# Altium schematic sheet PROC051C_RST_LEDs.SchDoc: Pwr_RST_LEDs
size 431 x 279 mm; Date: Not shown in title block; ApprovedBy: Not shown in title block; CheckedBy: Not shown in title block; Author: Not shown in title block; CompanyName: Not shown in title block; Engineer: Not shown in title block; Organization: Not shown in title block; Address1: Not shown in title block; Address2: Not shown in title block; Address3: Not shown in title block; Address4: Not shown in title block; DocumentNumber: 8; Revision: Use project parameter SCH_Rev; SheetNumber: 8; SheetTotal: 16; PageSetup: Record=PageOptions|CenterHorizontal=True|CenterVertical=True|PrintScale=1.00|XCorrection=1.00|YCorrection=1.00|PrintKind=0|BorderSize=5000000|LeftOffset=0|BottomOffset=0|Orientation=2|PaperLength=1000|PaperWidth=1000|Scale=100|PaperSource=15|PrintQuality=600|MediaType=1|DitherType=10|PaperKind=Letter|PrintScaleMode=1; CurrentTime: Not shown in title block; CurrentDate: Not shown in title block; Time: Not shown in title block; DocumentFullPathAndName: Not shown in title block; DocumentName: Not shown in title block; ModifiedDate: Not shown in title block; ImagePath: Not shown in title block
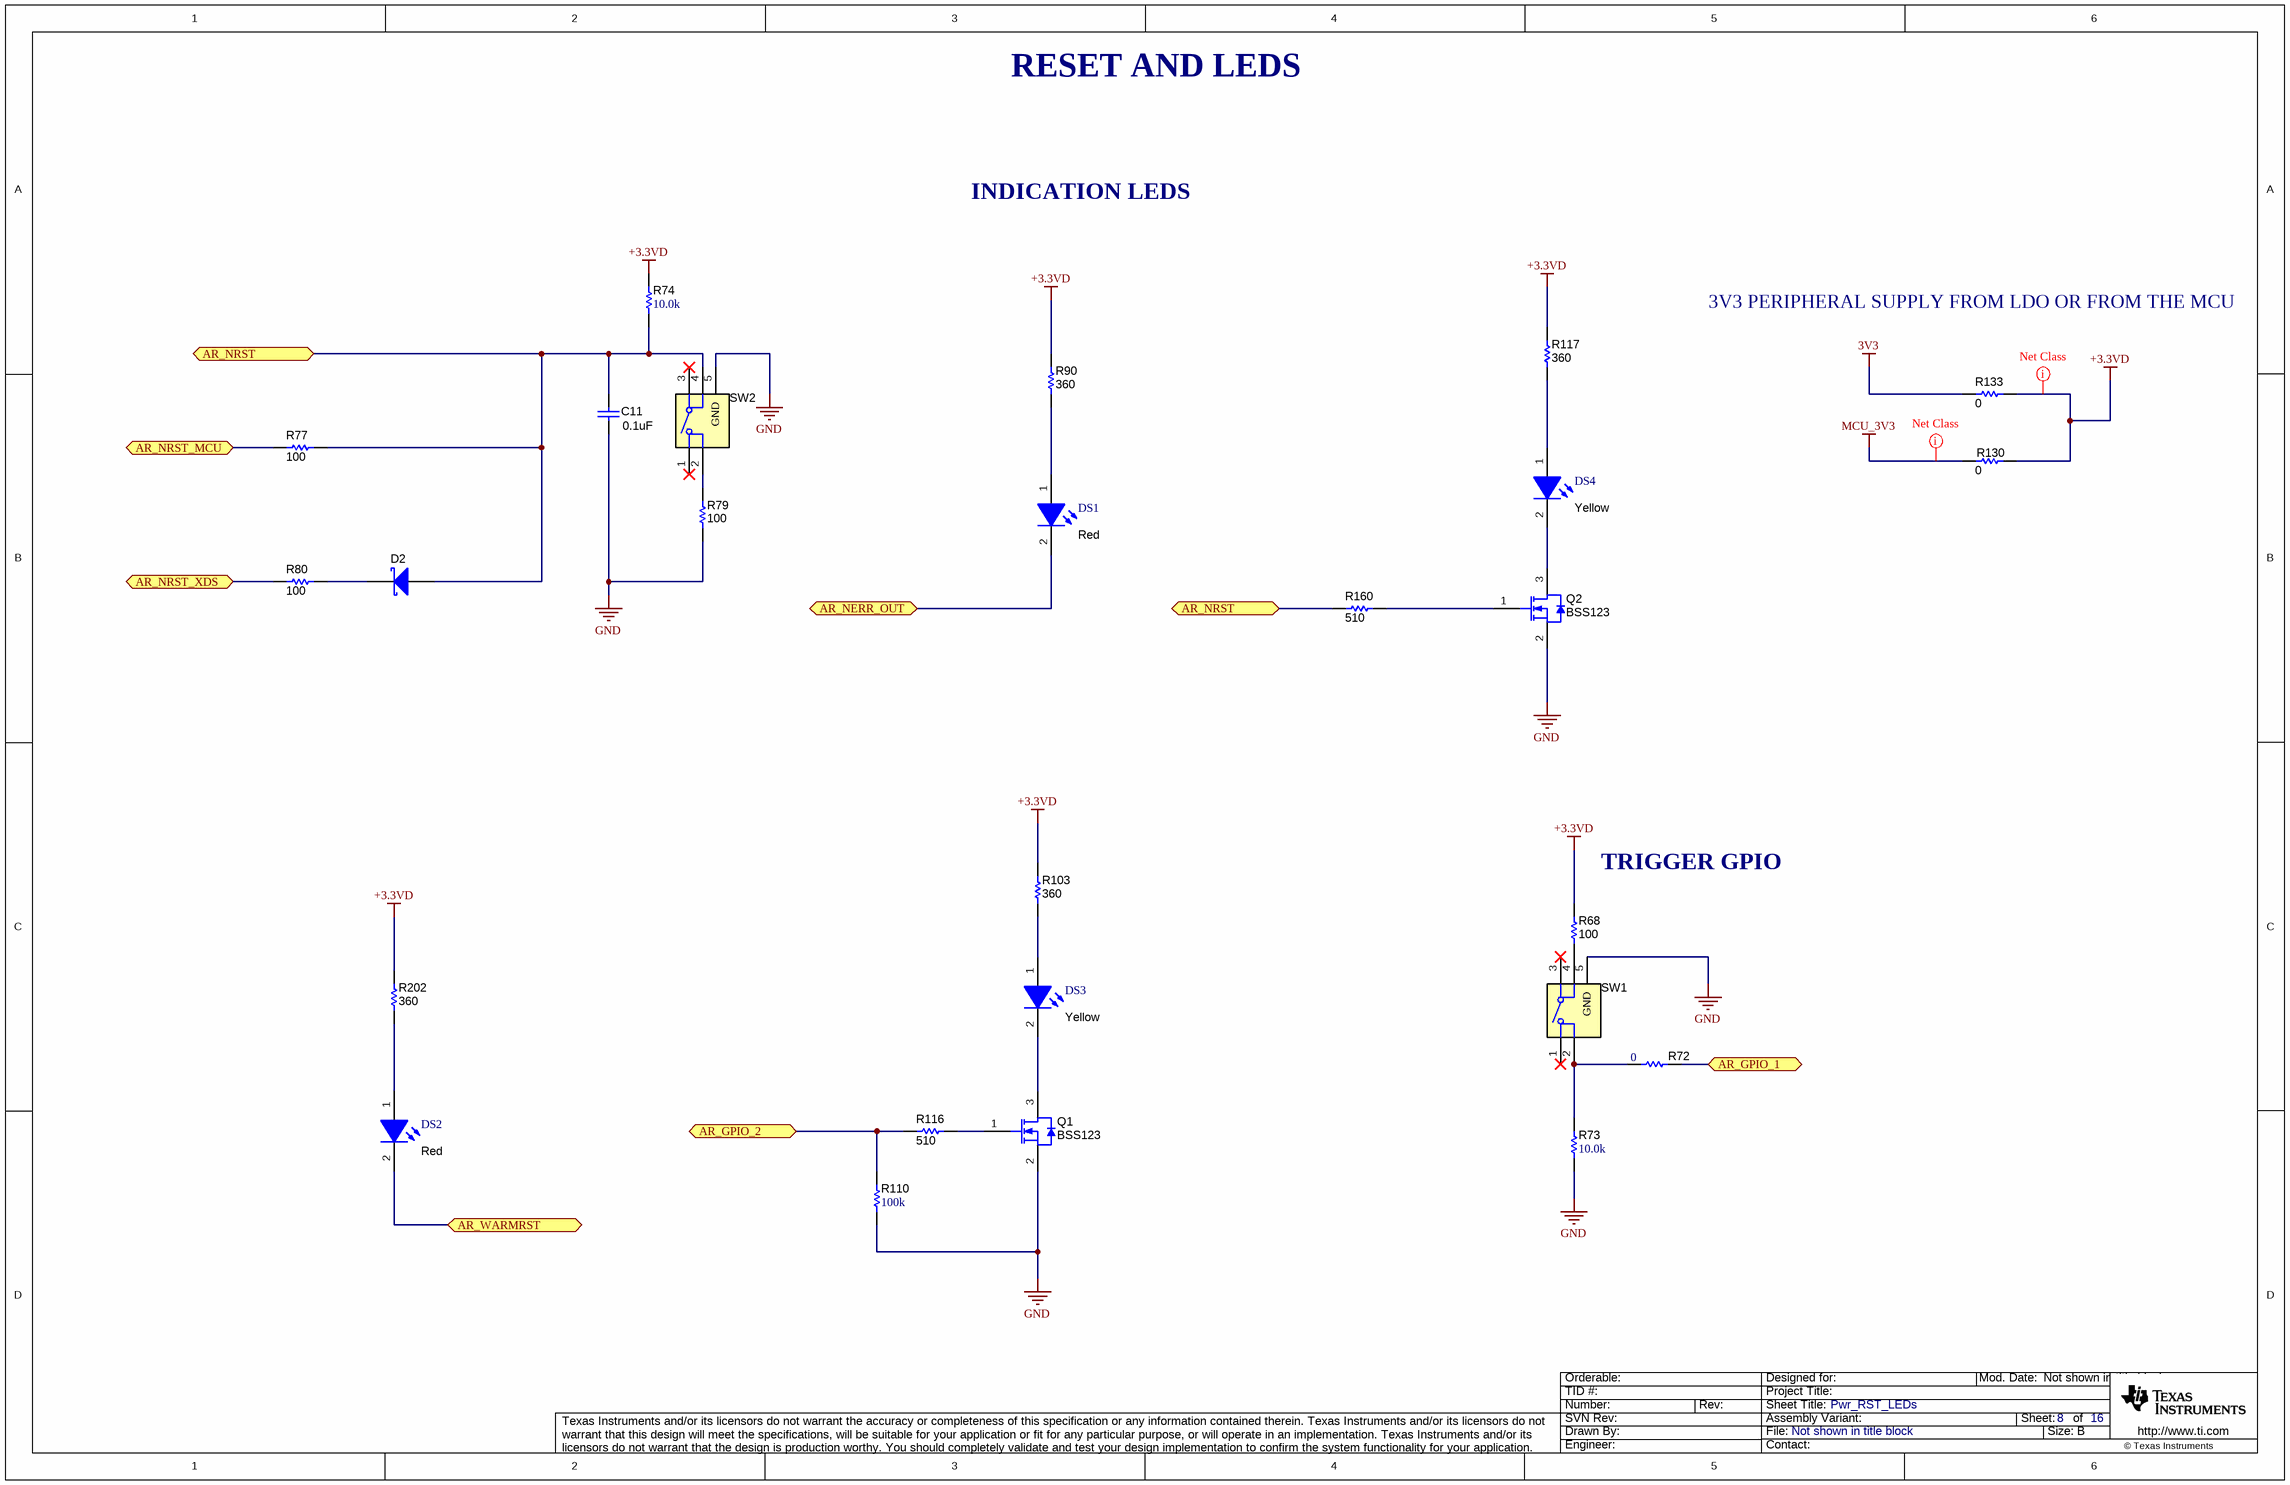
[diagram p0: PROC051C_RST_LEDs.SchDoc]

## Parts
C11  ValueDisplayed: 0.1uF  [0402L]  (hidden comment: GCM155R71C104KA55D)
D2  SMS3923-040LF  [SOD-882]  (value not drawn)
DS1  value Red  [LS L29K_Red]  (hidden comment: LS L29K-G1J2-1-Z)
DS2  value Red  [LS L29K_Red]  (hidden comment: LS L29K-G1J2-1-Z)
DS3  value Yellow  [SML-E1_Yellow]  (hidden comment: SML-E12Y8WT86)
DS4  value Yellow  [SML-E1_Yellow]  (hidden comment: SML-E12Y8WT86)
Q1  BSS123  [SOT-23]
Q2  BSS123  [SOT-23]
R68  ValueDisplayed: 100  [0402L]  (hidden comment: ERJ-2GEJ101X)
R72  ValueDisplayed: 0  [0201_Silk]  (hidden comment: CRCW02010000Z0ED)
R73  ValueDisplayed: 10.0k  [0402L]  (hidden comment: CRCW040210K0FKED)
R74  ValueDisplayed: 10.0k  [0402L]  (hidden comment: CRCW040210K0FKED)
R77  ValueDisplayed: 100  [0402L]  (hidden comment: ERJ-2GEJ101X)
R79  ValueDisplayed: 100  [0402L]  (hidden comment: ERJ-2GEJ101X)
R80  ValueDisplayed: 100  [0402L]  (hidden comment: ERJ-2GEJ101X)
R90  ValueDisplayed: 360  [0402L]  (hidden comment: ERJ-2GEJ361X)
R103  ValueDisplayed: 360  [0402L]  (hidden comment: ERJ-2GEJ361X)
R110  ValueDisplayed: 100k  [0402L]  (hidden comment: CRCW0402100KFKED)
R116  ValueDisplayed: 510  [0402L]  (hidden comment: ERJ-2GEJ511X)
R117  ValueDisplayed: 360  [0402L]  (hidden comment: ERJ-2GEJ361X)
R130  ValueDisplayed: 0  [0603]  (hidden comment: MCT06030Z0000ZP500)
R133  ValueDisplayed: 0  [0603]  (hidden comment: MCT06030Z0000ZP500)
R160  ValueDisplayed: 510  [0402L]  (hidden comment: ERJ-2GEJ511X)
R202  ValueDisplayed: 360  [0402L]  (hidden comment: ERJ-2GEJ361X)
SW1  KMR243GLFG  [SW_KMR243GLFG]  (value not drawn)
SW2  KMR243GLFG  [SW_KMR243GLFG]  (value not drawn)

## Ports
AR_GPIO_1, AR_GPIO_2, AR_NERR_OUT, AR_NRST, AR_NRST_MCU, AR_NRST_XDS, AR_WARMRST

## Nets
3V3: R133.1
+3.3VD: R68.2 R74.2 R90.2 R103.2 R117.2 R130.2 R133.2 R202.2
GND: C11.1 Q1.2(S) Q2.2(S) R73.1 R79.1 R110.1 SW1.5(GND) SW2.5(GND)
MCU_3V3: R130.1
AR_GPIO_1: R72.2 ; port AR_GPIO_1
AR_GPIO_2: R110.2 R116.1 ; port AR_GPIO_2
AR_NERR_OUT: DS1.2(K) ; port AR_NERR_OUT
AR_NRST: C11.2 D2.2(A) R74.1 R77.2 R160.1 SW2.4 ; port AR_NRST
AR_NRST_MCU: R77.1 ; port AR_NRST_MCU
AR_NRST_XDS: R80.1 ; port AR_NRST_XDS
AR_WARMRST: DS2.2(K) ; port AR_WARMRST
NetD2_1: D2.1(K) R80.2
NetDS1_1: DS1.1(A) R90.1
NetDS2_1: DS2.1(A) R202.1
NetDS3_1: DS3.1(A) R103.1
NetDS3_2: DS3.2(K) Q1.3(D)
NetDS4_1: DS4.1(A) R117.1
NetDS4_2: DS4.2(K) Q2.3(D)
NetQ1_1: Q1.1(G) R116.2
NetQ2_1: Q2.1(G) R160.2
NetR68_1: R68.1 SW1.4
NetR72_1: R72.1 R73.2 SW1.2
NetR79_2: R79.2 SW2.2

Not connected (* = marked no-connect by the designer): SW1 1* 3*; SW2 1* 3*

## Layout directives
net class PWR: +3.3VD, MCU_3V3

## Notes on the sheet
- RESET AND LEDS
- INDICATION LEDS
- 3V3 PERIPHERAL SUPPLY FROM LDO OR FROM THE MCU
- (near R68) TRIGGER GPIO
- Drawn By:
- SVN Rev:
- Number:
- TID #:
- Orderable:
- Rev:
- Sheet Title:
- File:
- Project Title:
- Designed for:
- Assembly Variant:
- Mod. Date:
- Sheet:
- Size:
- of
- B
- http://www.ti.com
- Texas Instruments and/or its licensors do not warrant the accuracy or completeness of this specification or any information contained therein. Texas Instruments and/or its licensors do not warrant that this design will meet the specifications, will be suitable for your application or fit for any particular purpose, or will operate in an implementation. Texas Instruments and/or its licensors do not warrant that the design is production worthy. You should completely validate and test your design implementation to confirm the system functionality for your application.
- Engineer:
- Contact:
- © Texas Instruments

## Library data of the parts
C11 = CMP-0006351-2: CAP, CERM, 0.1 uF, 16 V, +/- 10%, X7R, 0402; Manufacturer: MuRata; TaMin_C: -55°C; Polarized: N; SizeAreaWB_mm2: 3; Value1: Unknown; U/M: EA; Value: 0.1uF; TaMax_C: 125°C; SizeZ_mm: 0.6; SizeX_mm: 1; SizeY_mm: 0.5; Cap_Case: 0402; Value2: 16V; Cap_F: 100nF; AEC Category: Q200; Publisher: Texas Instruments; TempCo: X7R; Published: 2008-06-19; RoHS: Y; MountType: SMT; Supplier 1: Digi-Key; PackageReference: 0402; Tolerance_%: 10%; SizeArea_mm2: 0.5; CompType: Capacitor; LatestRevisionDate: 2017-03-09; PartNumber: GCM155R71C104KA55D; AEC Qualified: ?; VDC_V: 16V; ComponentLink1Description: Datasheet link; Supplier Part Number 1: 490-4759-2-ND; Technology: Ceramic; ComponentLink1URL: http://psearch.murata.com/capacitor/product/GCM155R71C104KA55%23.pdf
D2 = CMP-0078187-2: Diode, Schottky,  V, 0.01 A, SOD-882; Manufacturer: Skyworks Solutions; SizeAreaWB_mm2: 3.2; SizeArea_mm2: 0.6; AEC Qualified: N; TJmax_C: 150°C; AEC Category: Q101; SizeZ_mm: 0.5; Io_A: 10mA; Vf_V: 340mV; Value2: 0.34V; Value1: 0.01A; SizeX_mm: 1; ComponentLink1Description: Datasheet link; RoHS: Y; PackageReference: SOD-882; Value: V; PartNumber: SMS3923-040LF; SizeY_mm: 0.6; ComponentLink1URL: http://www.skyworksinc.com/uploads/documents/SMS392x_Series_200042AC.pdf; CompType: Diode; MountType: SMT; Type: Schottky
DS1 DS2 = CMP-0002902-2: LED, Red, SMD; Manufacturer: OSRAM; Io_A: 20mA; Vr_V: 12V; Tjmax_C: 110°C; Value1: W; Angle: 160; Vf_V: 1.8V; ComponentLink1URL: http://www.osram-os.com/Graphics/XPic2/00077099_0.pdf; Color: Red; RoHS: Y; MountType: SMT; PackageReference: SMD, 2-Leads, Body 1.3x0.8mm; Value2: 1.8V; CompType: LED; Type: ?; PartNumber: LS L29K-G1J2-1-Z; ComponentLink1Description: Datasheet link
DS3 DS4 = CMP-0002977-3: LED, Yellow, SMD; Manufacturer: Rohm; Io_A: 20mA; Power_TotalModule: 54mW; Vr_V: 5V; Tjmax_C: 85°C; Value1: 0.054W; Ir_A: 10µA; Vf_V: 2.2V; LuminousIntensity_IV: 63; Color: yellow; RoHS: Y; MountType: SMT; PackageReference: 1.6x0.8mm; Value2: 2.2V; CompType: LED; Type: ?; PartNumber: SML-E12Y8WT86; ComponentLink1Description: Datasheet link; ComponentLink1URL: http://rohmfs.rohm.com/en/products/databook/datasheet/opto/led/chip_mono/sml-e1.pdf
Q1 Q2 = CMP-0000947-2: MOSFET, N-CH, 100 V, 0.17 A, SOT-23; Alternate Manufacturer: None; Manufacturer: Fairchild Semiconductor; SizeZ_mm: 1.1; ChType: N; Value2: 1.8 nC; Value1: 1; VdsMax_V: 100V; SizeX_mm: 2.5; SizeY_mm: 3; Vgs_V: 20V; Value: 100V; Rdson45_ohm: 10; SizeArea_mm2: 7.5; AEC Category: Q101; IdsMax_A: 1.7dA; SizeAreaWB_mm2: 14; U/M: EA; QgTyp_nC: 1.8; Supplier 2: Newark; Supplier 3: Mouser; Supplier 1: Digi-Key; Supplier Part Number 1: BSS123NCT-ND; Supplier Part Number 2: 58K8768; PartNumber: BSS123; ComponentLink1Description: Datasheet link; LatestRevisionDate: 2017-03-09; CompType: MOSFET; PackageReference: SOT-23; LatestRevisionNote: Added parts.; Publisher: Texas Instruments; AEC Qualified: ?; Published: 2008-06-19; Supplier Part Number 3: 512-BSS123; RoHS: Y; MountType: SMT; ComponentLink1URL: http://www.fairchildsemi.com/ds/BS/BSS123.pdf
R68 R77 R79 R80 = CMP-0026993-2: RES, 100, 5%, 0.1 W, AEC-Q200 Grade 0, 0402; Manufacturer: Panasonic; Power_W: 100mW; TempCo: 200 ppm/C; Value_Code: 100R; U/M: EA; Value: 100; EIA_Code: E24; SizeX_mm: 1; SizeY_mm: 0.5; SizeZ_mm: 0.6; Value2: 0.1W; AEC Qualified: Y; AEC Grade: 0; AEC Category: Q200; Supplier Part Number 2: 65T8246; Publisher: Texas Instruments; Supplier 2: Newark; Supplier Part Number 3: 2059210; Supplier 3: Farnell; Published: 2008-06-26; RoHS: Y; Value1: 5%; MountType: SMT; Supplier 1: Digi-Key; PackageReference: 0402; Tolerance_%: 5%; Res_ohm: 100; SizeArea_mm2: 0.5; CompType: Resistor; LatestRevisionDate: 2017-03-09; PartNumber: ERJ-2GEJ101X; ComponentLink1Description: Datasheet link; Supplier Part Number 1: P100JCT-ND; Technology: Thick Film; ComponentLink1URL: https://industrial.panasonic.com/cdbs/www-data/pdf/RDA0000/AOA0000C84.pdf
R72 = CMP-0027008-4: RES, 0, 5%, 0.05 W, 0201; Manufacturer: Vishay-Dale; Power_W: 50mW; TempCo: ppm/C; Value_Code: 0000; Value: 0; EIA_Code: E24; SizeX_mm: 0.6; SizeY_mm: 0.3; SizeZ_mm: 0.26; Value2: 0.05W; SizeArea_mm2: 0.18; AEC Qualified: N; AEC Category: Q200; RoHS: E; Value1: 5%; MountType: SMT; Supplier 1: Newark; PackageReference: 0201; Tolerance_%: 5%; Res_ohm: 0; CompType: Resistor; PartNumber: CRCW02010000Z0ED; ComponentLink1Description: Datasheet link; AEC Grade: N/A; Supplier Part Number 1: 72M6743; Technology: Thick Film; ComponentLink1URL: http://www.vishay.com/docs/20052/crcw0201e3.pdf
R73 R74 = CMP-0025958-3: RES, 10.0 k, 1%, 0.063 W, AEC-Q200 Grade 0, 0402; Manufacturer: Vishay-Dale; Power_W: 63mW; TempCo: 100 ppm/C; Value_Code: 10k0; Value: 10.0k; EIA_Code: E96; Res_ohm: 10k; SizeX_mm: 1; SizeY_mm: 0.5; SizeZ_mm: 0.6; Value2: 0.063W; AEC Qualified: Y; VDC_V: 50V; AEC Category: Q200; AEC Grade: 0; Supplier Part Number 2: 52K6595; Supplier 2: Newark; Supplier Part Number 3: 71-CRCW0402-10K-E3; Supplier 3: Mouser; RoHS: E; Value1: 1%; MountType: SMT; Supplier 1: Digi-Key; PackageReference: 0402; Tolerance_%: 1%; SizeArea_mm2: 0.5; CompType: Resistor; PartNumber: CRCW040210K0FKED; ComponentLink1Description: Datasheet link; Supplier Part Number 1: 541-10.0KLCT-ND; Technology: Thick Film; ComponentLink1URL: http://www.vishay.com/docs/20035/dcrcwe3.pdf
R90 R103 R117 R202 = CMP-0078194-1: RES, 360, 5%, 0.1 W, AEC-Q200 Grade 0, 0402; Manufacturer: Panasonic; Value_Code: 360R; SizeArea_mm2: 0.5; AEC Qualified: Y; AEC Category: Q200; Value: 360; SizeZ_mm: 0.6; EIA_Code: E24; TempCo: 200 ppm/C; AEC Grade: 0; Power_W: 100mW; VDC_V: 50V; Value2: 0.1W; U/M: EA; SizeX_mm: 1; ComponentLink1Description: Datasheet link; RoHS: Y; Supplier Part Number 3: 667-ERJ-2GEJ361X; Tolerance_%: 5%; Supplier 1: Digi-Key; PackageReference: 0402; Technology: Thick Film; Res_ohm: 360; PartNumber: ERJ-2GEJ361X; Supplier Part Number 2: 53W4165; Supplier 2: Newark; SizeY_mm: 0.5; ComponentLink1URL: https://industrial.panasonic.com/cdbs/www-data/pdf/RDA0000/DMA0000COL9.pdf; Value1: 5%; CompType: Resistor; MountType: SMT; Supplier Part Number 1: P360JCT-ND; Supplier 3: Mouser
R110 = CMP-0025950-3: RES, 100 k, 1%, 0.063 W, AEC-Q200 Grade 0, 0402; Manufacturer: Vishay-Dale; Power_W: 63mW; TempCo: 100 ppm/C; Value: 100k; EIA_Code: E96; SizeX_mm: 1; SizeY_mm: 0.5; SizeZ_mm: 0.6; Value2: 0.063W; AEC Qualified: Y; VDC_V: 50V; AEC Category: Q200; AEC Grade: 0; Supplier Part Number 2: 52K6607; Supplier 2: Newark; Supplier Part Number 3: 71-CRCW0402-100K-E3; Supplier 3: Mouser; Value_Code: 100k; RoHS: E; Value1: 1%; MountType: SMT; Supplier 1: Digi-Key; PackageReference: 0402; Tolerance_%: 1%; Res_ohm: 100k; SizeArea_mm2: 0.5; CompType: Resistor; PartNumber: CRCW0402100KFKED; ComponentLink1Description: Datasheet link; Supplier Part Number 1: 541-100KLCT-ND; Technology: Thick Film; ComponentLink1URL: http://www.vishay.com/docs/20035/dcrcwe3.pdf
R116 R160 = CMP-0078212-1: RES, 510, 5%, 0.1 W, AEC-Q200 Grade 0, 0402; Manufacturer: Panasonic; Value_Code: 510R; SizeArea_mm2: 0.5; AEC Qualified: Y; AEC Category: Q200; Value: 510; SizeZ_mm: 0.6; EIA_Code: E24; TempCo: 200 ppm/C; AEC Grade: 0; Power_W: 100mW; VDC_V: 50V; Value2: 0.1W; U/M: EA; SizeX_mm: 1; ComponentLink1Description: Datasheet link; RoHS: Y; Supplier Part Number 3: 667-ERJ-2GEJ511X; Tolerance_%: 5%; Supplier 1: Digi-Key; PackageReference: 0402; Technology: Thick Film; Res_ohm: 510; PartNumber: ERJ-2GEJ511X; Supplier Part Number 2: 65T8293; Supplier 2: Newark; SizeY_mm: 0.5; ComponentLink1URL: https://industrial.panasonic.com/cdbs/www-data/pdf/RDA0000/DMA0000COL9.pdf; Value1: 5%; CompType: Resistor; MountType: SMT; Supplier Part Number 1: P510JCT-ND; Supplier 3: Mouser
R130 = CMP-0025884-3: RES, 0, 5%, 0.125 W, 0603; Manufacturer: Vishay/Beyschlag; Power_W: 125mW; TempCo: ppm/C; Value_Code: 0000; U/M: EA; Value: 0; EIA_Code: E24; SizeX_mm: 1.6; SizeY_mm: 0.8; SizeZ_mm: 1; Value2: 0.125W; SizeArea_mm2: 1.28; CompType: Resistor; AEC Qualified: N; AEC Category: Q200; Supplier Part Number 2: 96Y9454; Publisher: Texas Instruments; Supplier 2: Newark; Supplier Part Number 3: 594-MCT06030Z0000ZP5; Supplier 3: Mouser; Published: 2008-06-26; RoHS: Y; Value1: 5%; MountType: SMT; Supplier 1: Digi-Key; PackageReference: 0603; Tolerance_%: 5%; Res_ohm: 0; LatestRevisionDate: 2017-03-09; PartNumber: MCT06030Z0000ZP500; ComponentLink1Description: Datasheet link; AEC Grade: N/A; Supplier Part Number 1: MCT0603-0.0-ZZCT-ND; Technology: Thin Film; ComponentLink1URL: http://www.vishay.com/docs/28705/mcx0x0xpro.pdf
R133 = CMP-0025884-3: RES, 0, 5%, 0.125 W, 0603; Manufacturer: Vishay/Beyschlag; Power_W: 125mW; TempCo: ppm/C; Value_Code: 0000; U/M: EA; Value: 0; EIA_Code: E24; SizeX_mm: 1.6; SizeY_mm: 0.8; SizeZ_mm: 1; Value2: 0.125W; SizeArea_mm2: 1.28; AEC Qualified: N; AEC Category: Q200; Supplier Part Number 2: 96Y9454; Publisher: Texas Instruments; Supplier 2: Newark; Supplier Part Number 3: 594-MCT06030Z0000ZP5; Supplier 3: Mouser; Published: 2008-06-26; RoHS: Y; Value1: 5%; MountType: SMT; Supplier 1: Digi-Key; PackageReference: 0603; Tolerance_%: 5%; Res_ohm: 0; CompType: Resistor; LatestRevisionDate: 2017-03-09; PartNumber: MCT06030Z0000ZP500; ComponentLink1Description: Datasheet link; AEC Grade: N/A; Supplier Part Number 1: MCT0603-0.0-ZZCT-ND; Technology: Thin Film; ComponentLink1URL: http://www.vishay.com/docs/28705/mcx0x0xpro.pdf
SW1 SW2 = CMP-0002325-1: Switch, SPST-NO, Off-Mom, 0.01 A, 32 VDC, SMD; Manufacturer: C&K Components; CurrentRating_mA: 10A; PositionCount: 1; SizeX_mm: 4.6; SizeY_mm: 2.8; SizeZ_mm: 1.9; SizeArea_mm2: 12.88; VDC_V: 32V; SizeAreaWB_mm2: 21.28; Supplier 2: Mouser; Supplier 1: Digi-Key; Supplier Part Number 1: 401-1432-2-ND; Supplier Part Number 2: 611-KMR243GLFG; PartNumber: KMR243GLFG; ComponentLink1Description: Datasheet URL; LatestRevisionDate: 2017-03-09; ComponentLink1URL: http://www.ckswitches.com/media/1479/kmr2.pdf; CompType: Switch; Publisher: Texas Instruments; Circuit: SPST-NO; RoHS: Y; Orientation: Top Actuated; SwitchFunction: Off-Mom; PackageReference: 4.2x2.8mm; MountType: SMT